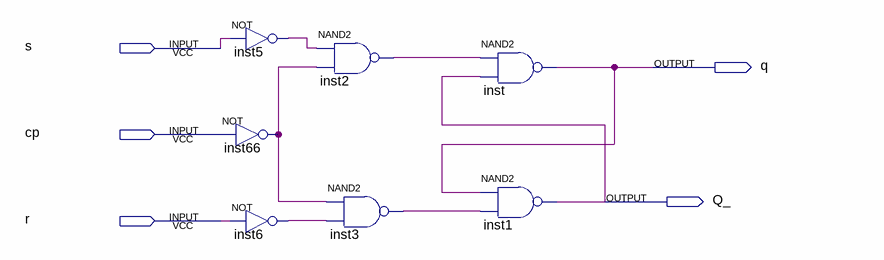
[diagram p0: schematic sheet]
// Quartus schematic work3_1.bdf as structural Verilog: 7 symbols, 5 pins
module work3_1 (
  input  s,
  input  cp,
  input  r,
  output q,
  output Q_
);

  wire inst2_out, inst3_out, inst5_out, inst6_out, inst66_out;

  not inst66 (inst66_out, cp);
  not inst5 (inst5_out, s);
  not inst6 (inst6_out, r);
  nand inst2 (inst2_out, inst5_out, inst66_out);
  nand inst3 (inst3_out, inst66_out, inst6_out);
  nand inst (q, inst2_out, Q_);
  nand inst1 (Q_, q, inst3_out);
endmodule
